# Altium project RTU v1.4.PrjPcb (part 2 of 2)

## Sheet LED.SchDoc
size A4; SheetNumber: 11; SheetTotal: 11
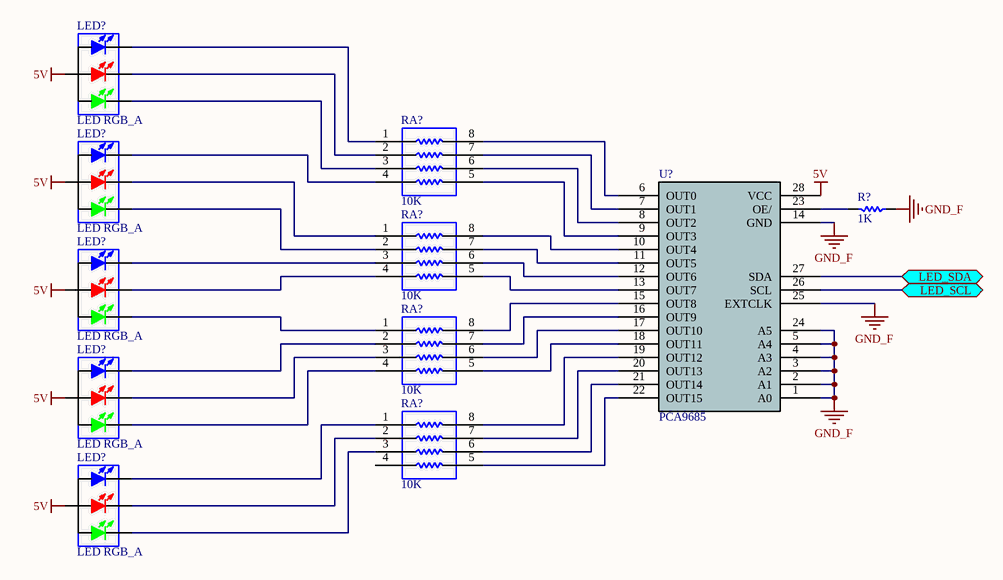
[diagram p11: LED.SchDoc]

### Parts
(Parts that share a designator on the sheet are numbered #1, #2 ... from top to bottom, then left to right.)
LED?#27  LED RGB_A  [RGB-020-A]
LED?#28  LED RGB_A  [RGB-020-A]
LED?#29  LED RGB_A  [RGB-020-A]
LED?#30  LED RGB_A  [RGB-020-A]
LED?#31  LED RGB_A  [RGB-020-A]
R?#76  1K  [R 0805]
RA?#3  10K  [RA1206 (4x0603)]
RA?#4  10K  [RA1206 (4x0603)]
RA?#5  10K  [RA1206 (4x0603)]
RA?#6  10K  [RA1206 (4x0603)]
U?#3  PCA9685  [TSSOP28]

### Ports
LED_SCL (bidir), LED_SDA (bidir)

### Nets
5V: LED?#27.3(RED_A) LED?#28.3(RED_A) LED?#29.3(RED_A) LED?#30.3(RED_A) LED?#31.3(RED_A) U?#3.28(VCC)  [project net VOUT]
GND_F: R?#76.1 U?#3.1(A0) U?#3.2(A1) U?#3.3(A2) U?#3.4(A3) U?#3.5(A4) U?#3.14(GND) U?#3.24(A5) U?#3.25(EXTCLK)
BASIC_SCL: U?#3.26(SCL) ; port LED_SCL
BASIC_SDA: U?#3.27(SDA) ; port LED_SDA
NetLED?#27_1: LED?#27.1(BULE_K) RA?#3.1
NetLED?#27_2: LED?#27.2(GREEN_K) RA?#3.3
NetLED?#27_4: LED?#27.4(RED_K) RA?#3.2
NetLED?#28_1: LED?#28.1(BULE_K) RA?#3.4
NetLED?#28_2: LED?#28.2(GREEN_K) RA?#4.2
NetLED?#28_4: LED?#28.4(RED_K) RA?#4.1
NetLED?#29_1: LED?#29.1(BULE_K) RA?#4.3
NetLED?#29_2: LED?#29.2(GREEN_K) RA?#5.1
NetLED?#29_4: LED?#29.4(RED_K) RA?#4.4
NetLED?#30_1: LED?#30.1(BULE_K) RA?#5.2
NetLED?#30_2: LED?#30.2(GREEN_K) RA?#5.4
NetLED?#30_4: LED?#30.4(RED_K) RA?#5.3
NetLED?#31_1: LED?#31.1(BULE_K) RA?#6.1
NetLED?#31_2: LED?#31.2(GREEN_K) RA?#6.3
NetLED?#31_4: LED?#31.4(RED_K) RA?#6.2
NetR?#76_2: R?#76.2 U?#3.23(OE/)
NetRA?#3_5: RA?#3.5 U?#3.9(OUT3)
NetRA?#3_6: RA?#3.6 U?#3.8(OUT2)
NetRA?#3_7: RA?#3.7 U?#3.7(OUT1)
NetRA?#3_8: RA?#3.8 U?#3.6(OUT0)
NetRA?#4_5: RA?#4.5 U?#3.13(OUT7)
NetRA?#4_6: RA?#4.6 U?#3.12(OUT6)
NetRA?#4_7: RA?#4.7 U?#3.11(OUT5)
NetRA?#4_8: RA?#4.8 U?#3.10(OUT4)
NetRA?#5_5: RA?#5.5 U?#3.18(OUT11)
NetRA?#5_6: RA?#5.6 U?#3.17(OUT10)
NetRA?#5_7: RA?#5.7 U?#3.16(OUT9)
NetRA?#5_8: RA?#5.8 U?#3.15(OUT8)
NetRA?#6_5: RA?#6.5 U?#3.22(OUT15)
NetRA?#6_6: RA?#6.6 U?#3.21(OUT14)
NetRA?#6_7: RA?#6.7 U?#3.20(OUT13)
NetRA?#6_8: RA?#6.8 U?#3.19(OUT12)

Not connected (* = marked no-connect by the designer): RA?#6 4

### Library data of the parts
R?#76 = R: Chip resistor; 版权归属: 源创客; BOM名称: Chip resistor; 学习资源: www.ooocke.com
RA?#3-RA?#6 = R-ARR: 4 way Chip Resistor Array
U?#3 = PCA9685: 16-channel, 12-bit PWM Fm+ I2C-bus PWM LED controller , Servo Motor

## Nets that join several sheets
3.3V: Main (10 pins), RS485 (8 pins), Power Regulator (C2.2 F2.2 LED5.1 U4.5), W5500 (13 pins), U_Analog Input (FB5_U_Analog_Input#1.1), U_Analog Input (FB5_U_Analog_Input#2.1), Transistor Output (7 pins), GPIO (10 pins), U_GPIO/U_GPIO SUB (C?_U_GPIO_U_GPIO_SUB#1.2 U?_U_GPIO_U_GPIO_SUB#2.5), U_GPIO/U_GPIO SUB (C?_U_GPIO_U_GPIO_SUB#2.2 U?_U_GPIO_U_GPIO_SUB#4.2 U?_U_GPIO_U_GPIO_SUB#4.5), U_GPIO/U_GPIO SUB (C?_U_GPIO_U_GPIO_SUB#3.2 U?_U_GPIO_U_GPIO_SUB#6.1 U?_U_GPIO_U_GPIO_SUB#6.5), U_GPIO/U_GPIO SUB (C?_U_GPIO_U_GPIO_SUB#4.2 U?_U_GPIO_U_GPIO_SUB#8.1 U?_U_GPIO_U_GPIO_SUB#8.2 U?_U_GPIO_U_GPIO_SUB#8.5), Opto Input (20 pins)
24V: Power Regulator (6 pins), U_Analog Output (U?_U_Analog_Output#3.8 U?_U_Analog_Output#5.8), U_Analog Output (U?_U_Analog_Output#8.8 U?_U_Analog_Output#10.8), Transistor Output (32 pins), U_GPIO/U_GPIO SUB (D?_U_GPIO_U_GPIO_SUB#1.2 R?_U_GPIO_U_GPIO_SUB#1.1 R?_U_GPIO_U_GPIO_SUB#3.1 U?_U_GPIO_U_GPIO_SUB#1.3), U_GPIO/U_GPIO SUB (D?_U_GPIO_U_GPIO_SUB#3.2 R?_U_GPIO_U_GPIO_SUB#7.1 R?_U_GPIO_U_GPIO_SUB#9.1 U?_U_GPIO_U_GPIO_SUB#3.3), U_GPIO/U_GPIO SUB (D?_U_GPIO_U_GPIO_SUB#5.2 R?_U_GPIO_U_GPIO_SUB#13.1 R?_U_GPIO_U_GPIO_SUB#15.1 U?_U_GPIO_U_GPIO_SUB#5.3), U_GPIO/U_GPIO SUB (D?_U_GPIO_U_GPIO_SUB#7.2 R?_U_GPIO_U_GPIO_SUB#19.1 R?_U_GPIO_U_GPIO_SUB#21.1 U?_U_GPIO_U_GPIO_SUB#7.3)
GND: Main (RA?#1.5 RA?#1.6), Power Regulator (22 pins), U_Analog Input (TZ5_U_Analog_Input#1.1 TZ6_U_Analog_Input#1.1 TZ7_U_Analog_Input#1.1 TZ8_U_Analog_Input#1.1), U_Analog Input (TZ5_U_Analog_Input#2.1 TZ6_U_Analog_Input#2.1 TZ7_U_Analog_Input#2.1 TZ8_U_Analog_Input#2.1), U_Analog Output (10 pins), U_Analog Output (10 pins), Transistor Output (16 pins), GPIO (7 pins), U_GPIO/U_GPIO SUB (9 pins), U_GPIO/U_GPIO SUB (8 pins), U_GPIO/U_GPIO SUB (8 pins), U_GPIO/U_GPIO SUB (7 pins), Opto Input (16 pins)
GND_F: Main (14 pins), RS485 (5 pins), Power Regulator (9 pins), W5500 (25 pins), U_Analog Input (FB6_U_Analog_Input#1.1), U_Analog Input (FB6_U_Analog_Input#2.1), Transistor Output (17 pins), GPIO (14 pins), U_GPIO/U_GPIO SUB (OP?_U_GPIO_U_GPIO_SUB#1.2), U_GPIO/U_GPIO SUB (OP?_U_GPIO_U_GPIO_SUB#2.2), U_GPIO/U_GPIO SUB (OP?_U_GPIO_U_GPIO_SUB#3.2), U_GPIO/U_GPIO SUB (OP?_U_GPIO_U_GPIO_SUB#4.2), Opto Input (36 pins), Buzzer (Q?.2 R?#75.1), LED (9 pins)
GNDA: U_Analog Input (8 pins), U_Analog Input (8 pins), GPIO (C6.1 C8.1 FB4.2 U10.3)
VDD: Main (R?#1.1), U_Analog Input (7 pins), U_Analog Input (7 pins), GPIO (8 pins)
VOUT: Main (JP15.A4 JP15.A9 JP15.B4 JP15.B9), Power Regulator (F1.2 LED6.1), U_Analog Output (C?_U_Analog_Output#1.2 C?_U_Analog_Output#2.2 U?_U_Analog_Output#2.9 U?_U_Analog_Output#2.10), U_Analog Output (C?_U_Analog_Output#3.2 C?_U_Analog_Output#4.2 U?_U_Analog_Output#7.9 U?_U_Analog_Output#7.10), GPIO (18 pins), Buzzer (B?.A), LED (6 pins)
ADS_IN0: GPIO (U10.4), U_GPIO/U_GPIO SUB (R?_U_GPIO_U_GPIO_SUB#5.2 R?_U_GPIO_U_GPIO_SUB#6.1)
ADS_IN1: GPIO (U10.5), U_GPIO/U_GPIO SUB (R?_U_GPIO_U_GPIO_SUB#17.2 R?_U_GPIO_U_GPIO_SUB#18.1)
ADS_IN2: GPIO (U10.6), U_GPIO/U_GPIO SUB (R?_U_GPIO_U_GPIO_SUB#11.2 R?_U_GPIO_U_GPIO_SUB#12.1)
ADS_IN3: GPIO (U10.7), U_GPIO/U_GPIO SUB (R?_U_GPIO_U_GPIO_SUB#23.2 R?_U_GPIO_U_GPIO_SUB#24.1)
ANALOG_SCL: Power Regulator (U4.4), U_Analog Input (R142_U_Analog_Input#1.1 U17_U_Analog_Input#1.10), U_Analog Input (R142_U_Analog_Input#2.1 U17_U_Analog_Input#2.10)
ANALOG_SDA: Power Regulator (U4.1 U4.3), U_Analog Input (R143_U_Analog_Input#1.1 U17_U_Analog_Input#1.9), U_Analog Input (R143_U_Analog_Input#2.1 U17_U_Analog_Input#2.9)
BASIC_SCL: Main (U?#1.12), LED (U?#3.26)
BASIC_SDA: Main (U?#1.13), LED (U?#3.27)
DIGITAL_SCL: Transistor Output (R?#4.1 U5.12), GPIO (R90.1 U10.10 U11.12), U_GPIO/U_GPIO SUB (U?_U_GPIO_U_GPIO_SUB#2.4), U_GPIO/U_GPIO SUB (U?_U_GPIO_U_GPIO_SUB#4.4), U_GPIO/U_GPIO SUB (U?_U_GPIO_U_GPIO_SUB#6.4), U_GPIO/U_GPIO SUB (U?_U_GPIO_U_GPIO_SUB#8.4), Opto Input (R?#39.1 U?#2.12)
DIGITAL_SDA: Transistor Output (R?#3.1 U5.13), GPIO (R91.1 U10.9 U11.13), U_GPIO/U_GPIO SUB (U?_U_GPIO_U_GPIO_SUB#2.3), U_GPIO/U_GPIO SUB (U?_U_GPIO_U_GPIO_SUB#4.3), U_GPIO/U_GPIO SUB (U?_U_GPIO_U_GPIO_SUB#6.3), U_GPIO/U_GPIO SUB (U?_U_GPIO_U_GPIO_SUB#8.3), Opto Input (R?#40.1 U?#2.13)
GPIO1: U_GPIO/U_GPIO SUB (F?_U_GPIO_U_GPIO_SUB#1.2 TZ?_U_GPIO_U_GPIO_SUB#1.2), U_GPIO/U_GPIO SUB (F?_U_GPIO_U_GPIO_SUB#2.2 TZ?_U_GPIO_U_GPIO_SUB#2.2), U_GPIO/U_GPIO SUB (F?_U_GPIO_U_GPIO_SUB#3.2 TZ?_U_GPIO_U_GPIO_SUB#3.2), U_GPIO/U_GPIO SUB (F?_U_GPIO_U_GPIO_SUB#4.2 TZ?_U_GPIO_U_GPIO_SUB#4.2)
GPIO_ADC_ALERT: Main (U?#1.25), GPIO (R92.1 U10.2)
GPIO_TRG_0: GPIO (U11.28), U_GPIO/U_GPIO SUB (R?_U_GPIO_U_GPIO_SUB#2.2)
GPIO_TRG_1: GPIO (U11.27), U_GPIO/U_GPIO SUB (R?_U_GPIO_U_GPIO_SUB#14.2)
GPIO_TRG_2: GPIO (U11.26), U_GPIO/U_GPIO SUB (R?_U_GPIO_U_GPIO_SUB#8.2)
GPIO_TRG_3: GPIO (U11.25), U_GPIO/U_GPIO SUB (R?_U_GPIO_U_GPIO_SUB#20.2)
MCP_INTA: Main (U?#1.28), GPIO (U11.20)
MCP_INTB: Main (U?#1.27), GPIO (U11.19)
MCP_RESET: Main (U?#1.26), GPIO (RA2.1 U11.18)
NetR?#1_2: Main (R?#1.2), U_Analog Input (U17_U_Analog_Input#1.1)
NetR?#2_2: Main (R?#2.2), U_Analog Input (U17_U_Analog_Input#2.1)
OI_INTA: Main (U?#1.1), Opto Input (U?#2.20)
OI_INTB: Main (U?#1.2), Opto Input (U?#2.19)
OI_RESET: Main (U?#1.3), Opto Input (RA?#2.1 U?#2.18)
TO_INTA: Main (U?#1.4), Transistor Output (U5.20)
TO_INTB: Main (U?#1.5), Transistor Output (U5.19)
TO_RESET: Main (U?#1.6), Transistor Output (RA1.1 U5.18)